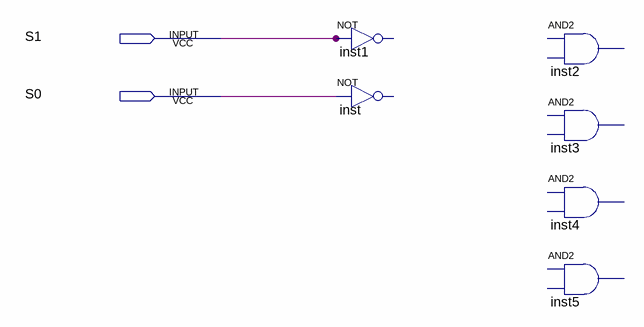
[diagram p0: schematic sheet]
// Quartus schematic Mux4.bdf as structural Verilog: 6 symbols, 2 pins
module Mux4 (
  input  S1,
  input  S0
);

  // NOT inst1 has open pins: IN=S1, OUT=open
  // NOT inst has open pins: IN=S0, OUT=open
  // AND2 inst2 is placed but not wired
  // AND2 inst3 is placed but not wired
  // AND2 inst4 is placed but not wired
  // AND2 inst5 is placed but not wired
endmodule
